# EAGLE design SparrowAprsArt (EAGLE 9.1.3)
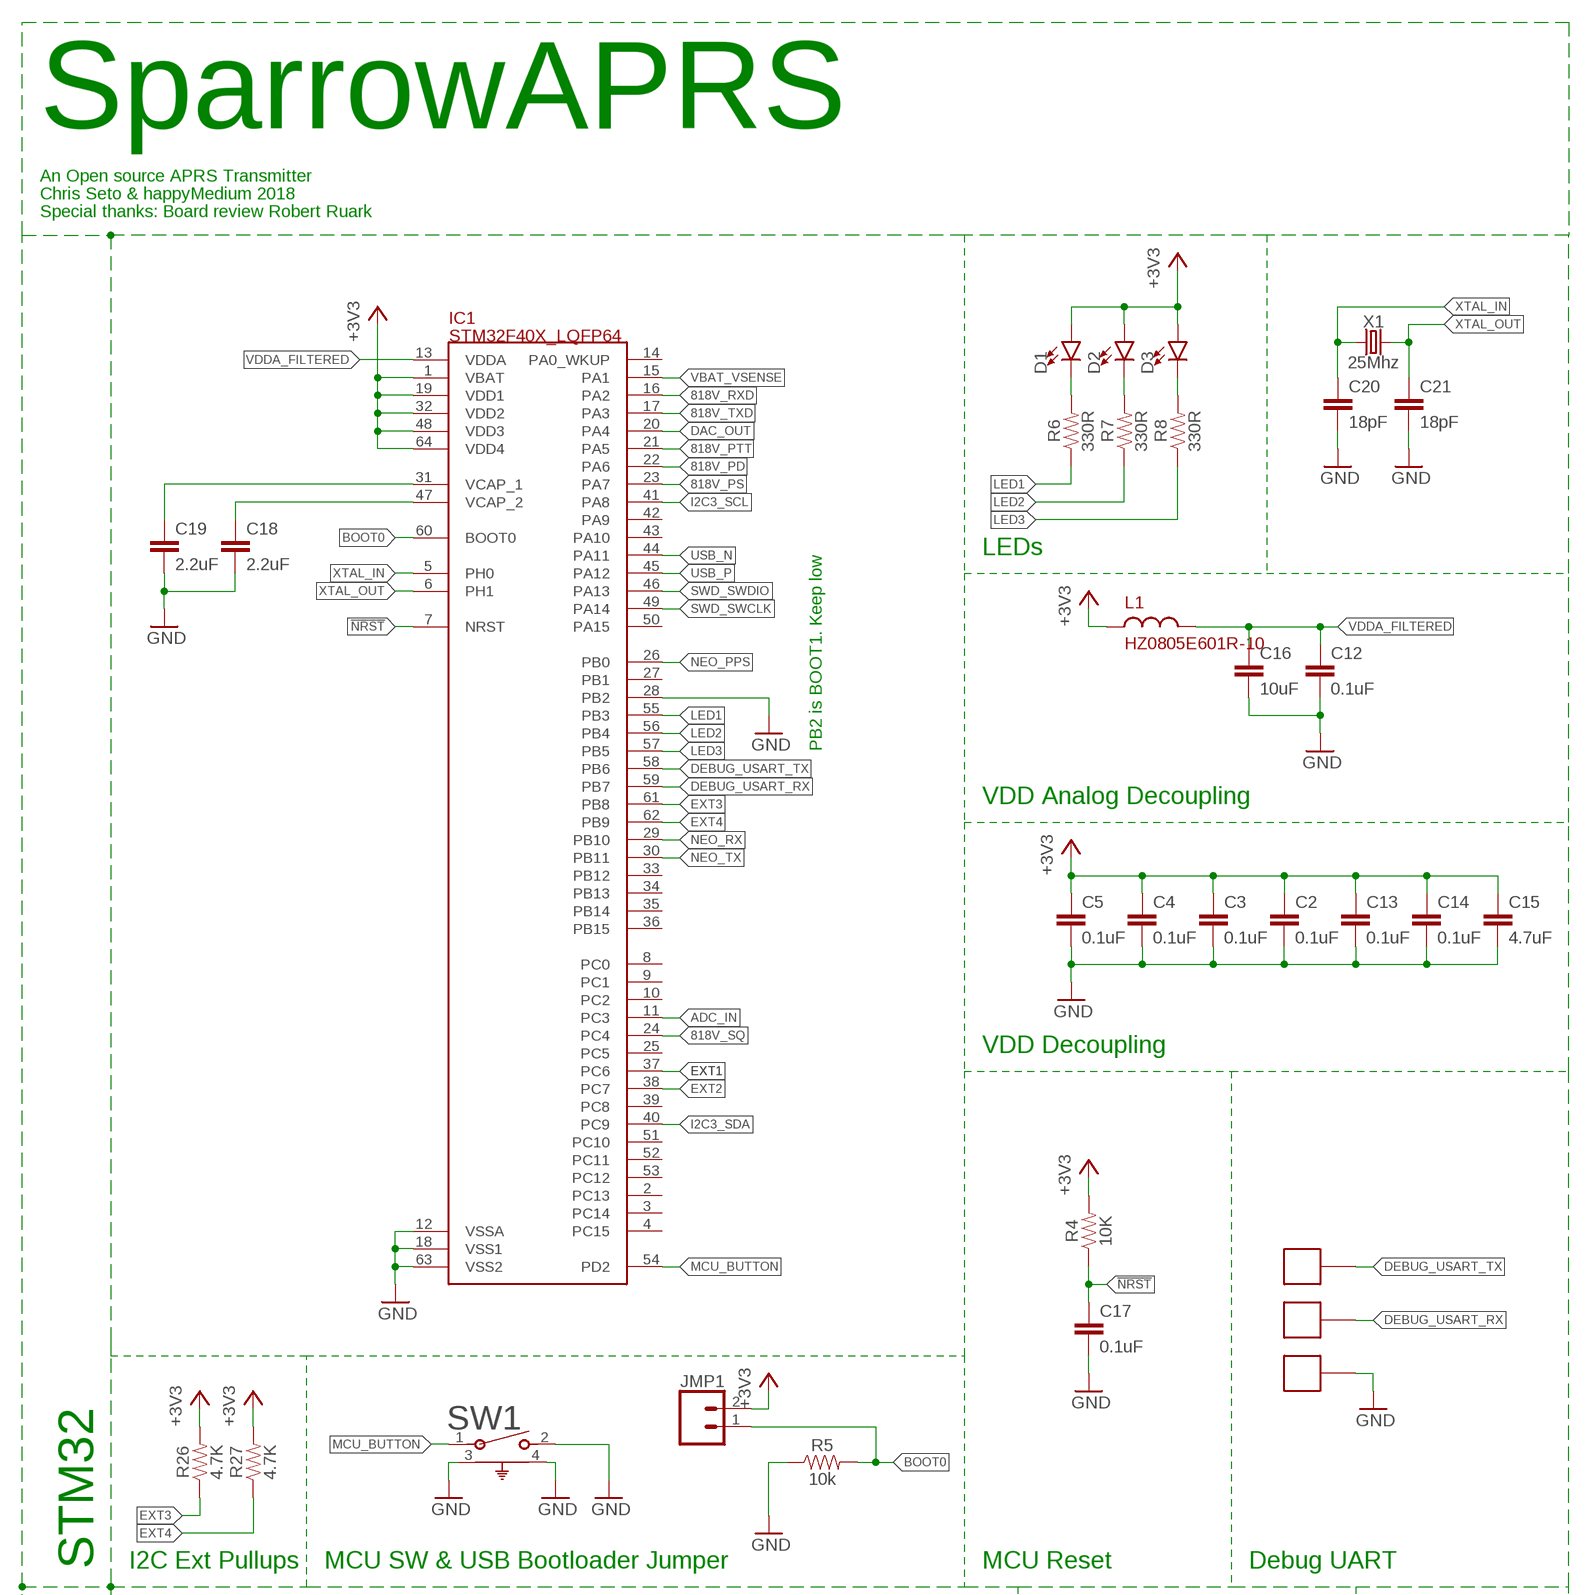
[diagram p0: schematic, sheet 1, part 1 of 2]
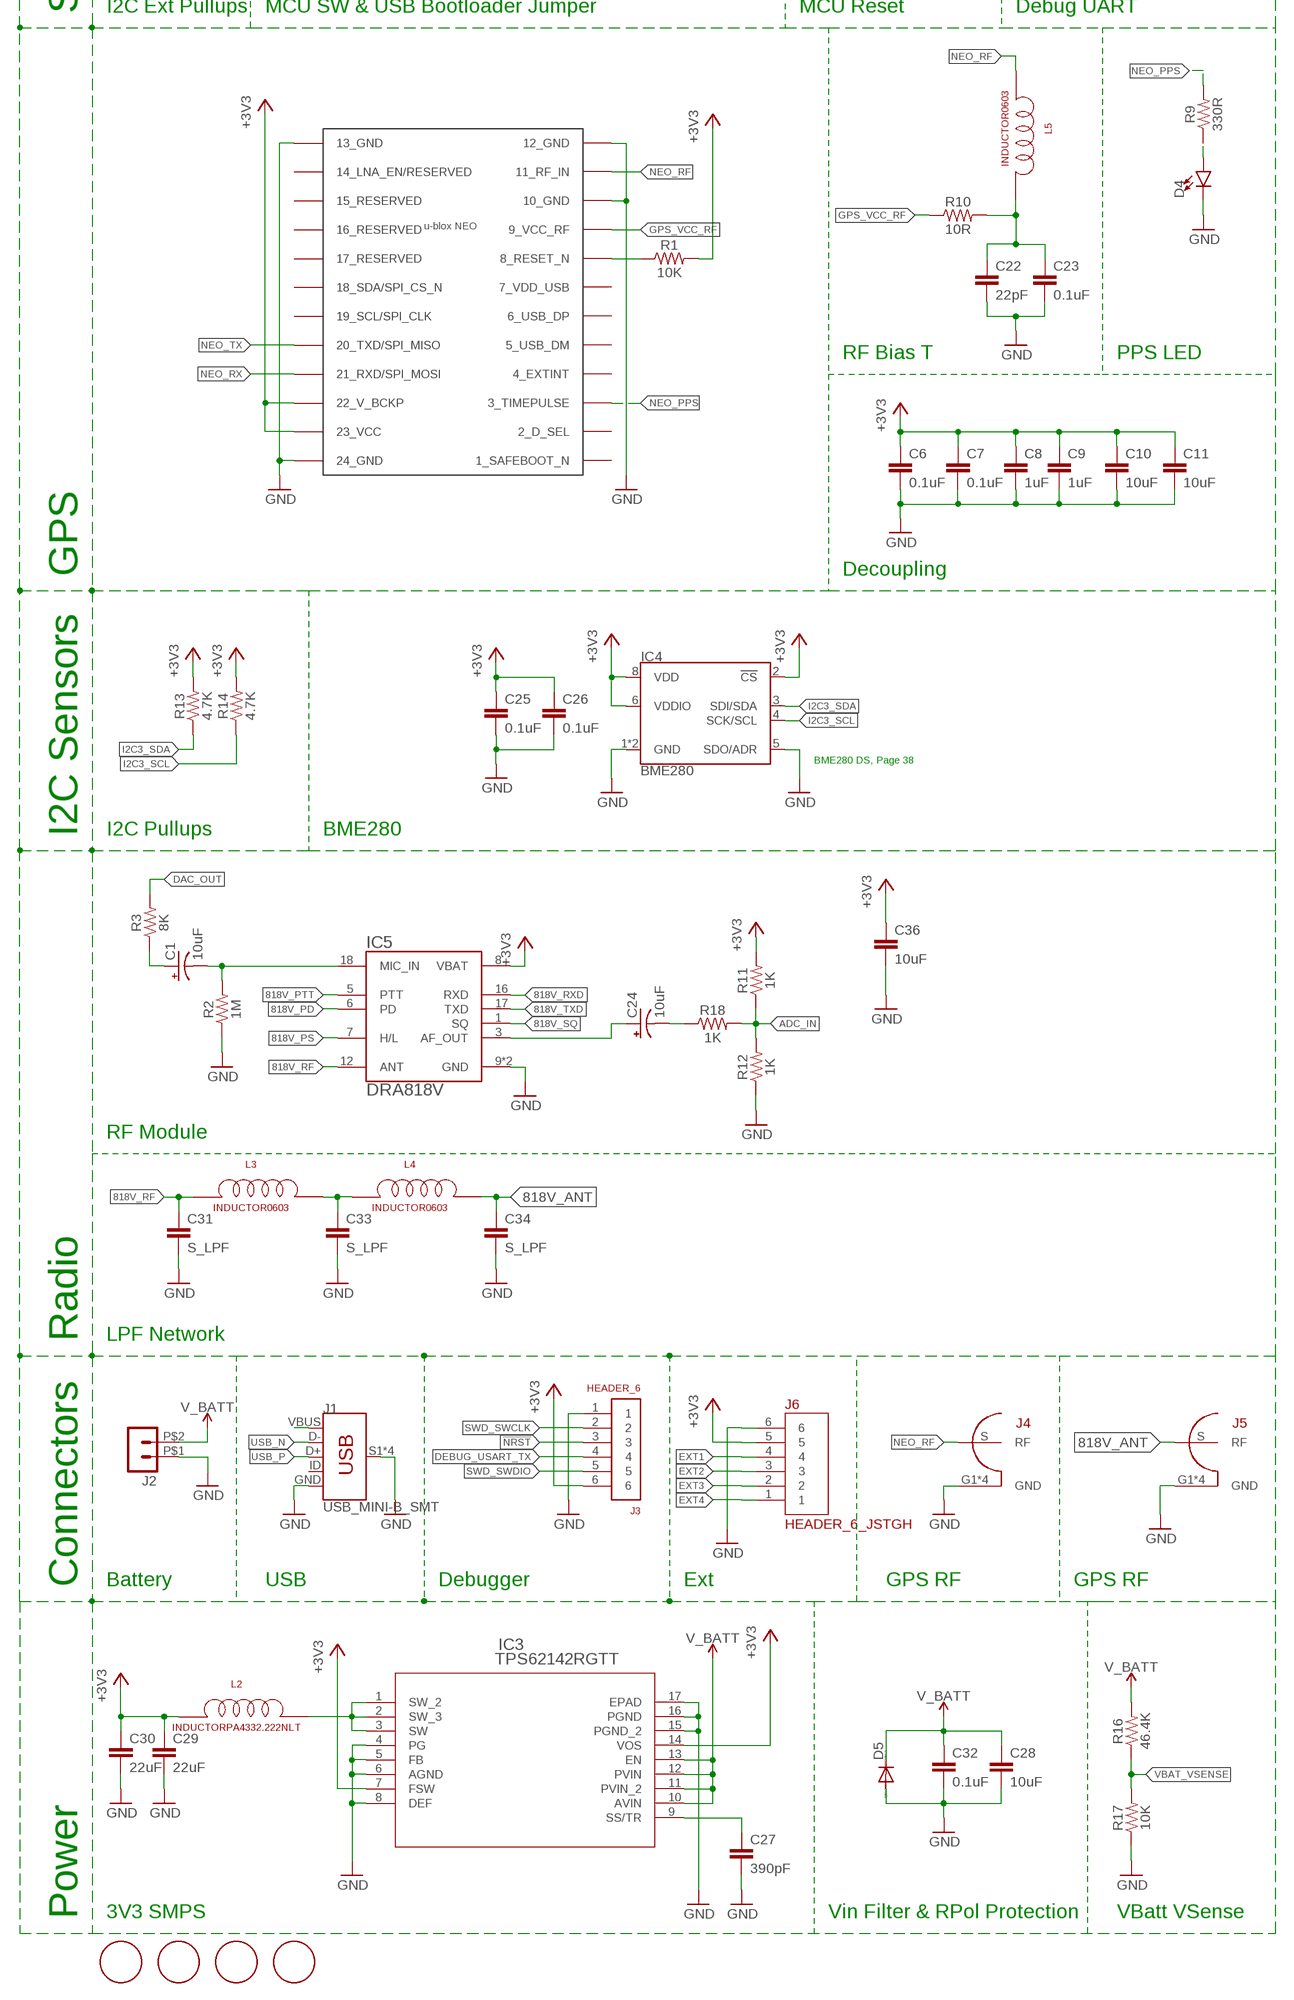
[diagram p1: schematic, sheet 1, part 2 of 2]

## Parts
C1  10uF  CAP_POL1206_POL  [1206]
C2  0.1uF  CAP0603  [0603]
C3  0.1uF  CAP0603  [0603]
C4  0.1uF  CAP0603  [0603]
C5  0.1uF  CAP0603  [0603]
C6  0.1uF  CAP0603  [0603]
C7  0.1uF  CAP0603  [0603]
C8  1uF  C-EUC0805  [C0805]
C9  1uF  C-EUC0805  [C0805]
C10  10uF  C-EUC0805  [C0805]
C11  10uF  C-EUC0805  [C0805]
C12  0.1uF  CAP0603  [0603]
C13  0.1uF  CAP0603  [0603]
C14  0.1uF  CAP0603  [0603]
C15  4.7uF  C-EUC0805  [C0805]
C16  10uF  C-EUC0805  [C0805]
C17  0.1uF  CAP0603  [0603]
C18  2.2uF  C-EUC0805  [C0805]
C19  2.2uF  C-EUC0805  [C0805]
C20  18pF  CAP0603  [0603]
C21  18pF  CAP0603  [0603]
C22  22pF  CAP0603  [0603]
C23  0.1uF  CAP0603  [0603]
C24  10uF  CAP_POL1206_POL  [1206]
C25  0.1uF  CAP0603  [0603]
C26  0.1uF  CAP0603  [0603]
C27  390pF  CAP0603  [0603]
C28  10uF  C-EUC0805  [C0805]
C29  22uF  CAP1210  [1210]
C30  22uF  CAP1210  [1210]
C31  S_LPF  CAP0603  [0603]
C32  0.1uF  CAP0603  [0603]
C33  S_LPF  CAP0603  [0603]
C34  S_LPF  CAP0603  [0603]
C36  10uF  C-EUC0805  [C0805]
D1  LED0603  [LED-0603]
D2  LED0603  [LED-0603]
D3  LED0603  [LED-0603]
D4  LED0603  [LED-0603]
D5  DIODE-DO214AC  [DO214AC]
IC1  STM32F40X_LQFP64  [STM32_LQFP64]
IC2  NEO-M8  [NEO-M8]
IC3  TPS62142RGTT  [RGT16_1P7X1P7]
IC4  BME280  [LGA-8-2.5X2.5]
IC5  DRA818V  [DORJI_DRA818V]
J1  USB_MINI-B_SMT  [USB-MINIB]
J2  HEADER_POS2_43650-0200  [43650-0200]
J3  HEADER_6  [6X2_SMT]
J4  FSK_RUARK2_SMA_0732511150  [FSK_RUARK2_WIDE_SMA]
J5  FSK_RUARK2_SMA_0732511150  [FSK_RUARK2_WIDE_SMA]
J6  HEADER_6_JSTGH  [BM06B-GHS-TBT(LF)(SN)(N)]
JMP1  CONN_02  [1X02]
L1  HZ0805E601R-10  [R0805]
L2  INDUCTORPA4332.222NLT  [PA4332.222NLT]
L3  INDUCTOR0603  [0603]
L4  INDUCTOR0603  [0603]
L5  INDUCTOR0603  [0603]
R1  10K  RESISTOR0603  [0603]
R2  1M  RESISTOR0603  [0603]
R3  8K  RESISTOR0603  [0603]
R4  10K  RESISTOR0603  [0603]
R5  10k  RESISTOR0603  [0603]
R6  330R  RESISTOR0603  [0603]
R7  330R  RESISTOR0603  [0603]
R8  330R  RESISTOR0603  [0603]
R9  330R  RESISTOR0603  [0603]
R10  10R  RESISTOR0603  [0603]
R11  1K  RESISTOR0603  [0603]
R12  1K  RESISTOR0603  [0603]
R13  4.7K  RESISTOR0603  [0603]
R14  4.7K  RESISTOR0603  [0603]
R16  46.4K  RESISTOR0603  [0603]
R17  10K  RESISTOR0603  [0603]
R18  1K  RESISTOR0603  [0603]
R26  4.7K  RESISTOR0603  [0603]
R27  4.7K  RESISTOR0603  [0603]
SW1  1825027-8  [SW2_1825027-C]
U$2  SINGLEPADMIDPAD  [MIDPAD]
U$3  SINGLEPADMIDPAD  [MIDPAD]
U$4  SINGLEPADMIDPAD  [MIDPAD]
U$7  MOUNTING_HOLE#2  [#2_CLEARANCE_HOLE]
U$8  MOUNTING_HOLE#2  [#2_CLEARANCE_HOLE]
U$9  MOUNTING_HOLE#2  [#2_CLEARANCE_HOLE]
U$10  MOUNTING_HOLE#2  [#2_CLEARANCE_HOLE]
X1  25Mhz  CRYSTALSMD-3.2X2.5  [CRYSTAL-SMD-3.2X2.5MM]

## Nets
818V_ANT: C34.1 J5.S(RF) L4.2
818V_PD: IC1.22(PA6) IC5.6(PD)
818V_PS: IC1.23(PA7) IC5.7(H/L)
818V_PTT: IC1.21(PA5) IC5.5(PTT)
818V_RF: C31.1 IC5.12(ANT) L3.1
818V_RXD: IC1.16(PA2) IC5.16(RXD)
818V_SQ: IC1.24(PC4) IC5.1(SQ)
818V_TXD: IC1.17(PA3) IC5.17(TXD)
!NRST: C17.1 IC1.7(NRST) J3.3 R4.1
+3V3: C2.1 C3.1 C4.1 C5.1 C6.1 C7.1 C8.1 C9.1 C10.1 C11.1 C13.1 C14.1 C15.1 C25.1 C26.1 C29.1 C30.1 C36.1 D1.A D2.A D3.A IC1.1(VBAT) IC1.19(VDD1) IC1.32(VDD2) IC1.48(VDD3) IC1.64(VDD4) IC2.22(22_V_BCKP) IC2.23(23_VCC) IC3.7(FSW) IC3.14(VOS) IC4.2(!CS) IC4.6(VDDIO) IC4.8(VDD) IC5.8(VBAT) J3.6 J6.5 JMP1.2 L1.1 L2.1 R1.2 R4.2 R11.2 R13.2 R14.2 R26.2 R27.2
ADC_IN: IC1.11(PC3) R11.1 R12.2 R18.2
BOOT0: IC1.60(BOOT0) JMP1.1 R5.2
DAC_OUT: IC1.20(PA4) R3.2
DEBUG_USART_RX: IC1.59(PB7) U$3.1
DEBUG_USART_TX: IC1.58(PB6) J3.4 U$2.1
EXT1: IC1.37(PC6) J6.4
EXT2: IC1.38(PC7) J6.3
EXT3: IC1.61(PB8) J6.2 R26.1
EXT4: IC1.62(PB9) J6.1 R27.1
GND: C2.2 C3.2 C4.2 C5.2 C6.2 C7.2 C8.2 C9.2 C10.2 C11.2 C12.2 C13.2 C14.2 C15.2 C16.2 C17.2 C18.2 C19.2 C20.2 C21.2 C22.2 C23.2 C25.2 C26.2 C27.2 C28.2 C29.2 C30.2 C31.2 C32.2 C33.2 C34.2 C36.2 D4.C D5.A IC1.12(VSSA) IC1.18(VSS1) IC1.28(PB2) IC1.63(VSS2) IC2.10(10_GND) IC2.12(12_GND) IC2.13(13_GND) IC2.24(24_GND) IC3.4(PG) IC3.5(FB) IC3.6(AGND) IC3.8(DEF) IC3.15(PGND_2) IC3.16(PGND) IC3.17(EPAD) IC4.1(GND) IC4.5(SDO/ADR) IC4.7(GND) IC5.9(GND) IC5.10(GND) J1.GND J1.S1(SHIELD) J1.S2(SHIELD) J1.S3(SHIELD) J1.S4(SHIELD) J2.P$1 J3.1 J4.G1(GND) J4.G2(GND) J4.G3(GND) J4.G4(GND) J5.G1(GND) J5.G2(GND) J5.G3(GND) J5.G4(GND) J6.6 R2.1 R5.1 R12.1 R17.1 SW1.2 SW1.3 SW1.4 U$4.1
GPS_VCC_RF: IC2.9(9_VCC_RF) R10.1
I2C3_SCL: IC1.41(PA8) IC4.4(SCK/SCL) R14.1
I2C3_SDA: IC1.40(PC9) IC4.3(SDI/SDA) R13.1
LED1: IC1.55(PB3) R6.1
LED2: IC1.56(PB4) R7.1
LED3: IC1.57(PB5) R8.1
MCU_BUTTON: IC1.54(PD2) SW1.1
N$2: C19.1 IC1.31(VCAP_1)
N$3: C18.1 IC1.47(VCAP_2)
N$4: IC2.8(8_RESET_N) R1.1
N$5: D2.C R7.2
N$7: D3.C R8.2
N$8: D1.C R6.2
N$9: C22.1 C23.1 L5.2 R10.2
N$10: D4.A R9.1
N$11: C1.1(+) R3.1
N$12: C24.2(-) R18.1
N$14: C1.2(-) IC5.18(MIC_IN) R2.2
N$15: C33.1 L3.2 L4.1
N$17: IC3.1(SW_2) IC3.2(SW_3) IC3.3(SW) L2.2
N$18: C24.1(+) IC5.3(AF_OUT)
N$19: J1.VBUS
N$21: C27.1 IC3.9(SS/TR)
NEO_PPS: IC1.26(PB0) IC2.3(3_TIMEPULSE) R9.2
NEO_RF: IC2.11(11_RF_IN) J4.S(RF) L5.1
NEO_RX: IC1.29(PB10) IC2.21(21_RXD/SPI_MOSI)
NEO_TX: IC1.30(PB11) IC2.20(20_TXD/SPI_MISO)
SWD_SWCLK: IC1.49(PA14) J3.2
SWD_SWDIO: IC1.46(PA13) J3.5
USB_N: IC1.44(PA11) J1.D-
USB_P: IC1.45(PA12) J1.D+
V_BATT: C28.1 C32.1 D5.C IC3.10(AVIN) IC3.11(PVIN_2) IC3.12(PVIN) IC3.13(EN) J2.P$2 R16.2
VBAT_VSENSE: IC1.15(PA1) R16.1 R17.2
VDDA_FILTERED: C12.1 C16.1 IC1.13(VDDA) L1.2
XTAL_IN: C20.1 IC1.5(PH0) X1.1
XTAL_OUT: C21.1 IC1.6(PH1) X1.3
Unconnected: IC1.2(PC13) IC1.3(PC14) IC1.4(PC15) IC1.8(PC0) IC1.9(PC1) IC1.10(PC2) IC1.14(PA0_WKUP) IC1.25(PC5) IC1.27(PB1) IC1.33(PB12) IC1.34(PB13) IC1.35(PB14) IC1.36(PB15) IC1.39(PC8) IC1.42(PA9) IC1.43(PA10) IC1.50(PA15) IC1.51(PC10) IC1.52(PC11) IC1.53(PC12) IC2.1(1_SAFEBOOT_N) IC2.2(2_D_SEL) IC2.4(4_EXTINT) IC2.5(5_USB_DM) IC2.6(6_USB_DP) IC2.7(7_VDD_USB) IC2.14(14_LNA_EN/RESERVED) IC2.15(15_RESERVED) IC2.16(16_RESERVED) IC2.17(17_RESERVED) IC2.18(18_SDA/SPI_CS_N) IC2.19(19_SCL/SPI_CLK) J1.ID

## Notes on the sheet
- SparrowAPRS
- An Open source APRS Transmitter
- Chris Seto & happyMedium 2018
- Special thanks: Board review Robert Ruark
- LEDs
- PB2 is BOOT1. Keep low
- VDD Analog Decoupling
- VDD Decoupling
- STM32 | I2C Ext Pullups | MCU SW & USB Bootloader Jumper | MCU Reset | Debug UART
- RF Bias T | PPS LED
- GPS | Decoupling
- BME280 DS, Page 38
- I2C Sensors | I2C Pullups | BME280
- RF Module
- Radio | LPF Network
- Connectors | Battery | USB | Debugger | Ext | GPS RF | GPS RF
- Power | 3V3 SMPS | Vin Filter & RPol Protection | VBatt VSense

## Library data of the parts
C1 C24 = HappyMedium:CAP_POL
C2-C7 C12-C14 C17 C20-C23 C25-C27 C29-C34 = HappyMedium:CAP
C8-C11 C15 C16 C18 C19 C28 C36 = resistor:C-EU: CAPACITOR, European symbol
D1-D4 = SparkFun-LED:LED: LED (Generic) Standard schematic elements and footprints for 5mm, 3mm, 1206, and 0603 sized LEDs. Generic LEDs with no color specified.
D5 = diode:DIODE-: DIODE
IC1 = HappyMedium:STM32F40X_LQFP64
IC2 = ubloxLib:NEO-M8: u-blox NEO GNSS module
IC3 = TPS62142RGTT:TPS62142RGTT; MANUFACTURER_PART_NUMBER: TPS62142RGTT; VENDOR: Texas Instruments
IC4 = SparkFun-Sensors:BME280: Bosch BME280 – Combined Humidity and Pressure Sensor The BME280 is as combined digital humidity, pressure and temperature sensor based on proven sensing principles. The sensor module is housed in an extremely compact metal-lid LGA package with a footprint of only 2.5×2.5mm² with a height of 0.93mm. Its small dimensions and its low power consumption allow the implementation in battery driven devices such as handsets, GPS modules or watches. Datasheet <https://cdn.sparkfun.com/assets/learn_tutorials/4/1/9/BST-BME280_DS001-10.pdf> SparkFun Products SparkFun Atmospheric Sensor Breakout - BME280 <https://www.sparkfun.com/products/13676> (SEN-13676); PROD_ID: IC-13090
IC5 = DRA818V:DRA818V: VHF Band Voice Transceiver Module; AVAILABILITY: Unavailable; MF: DORJI; MP: DRA818V; PACKAGE: Package Analog Devices; PRICE: None
J1 = SparkFun-Connectors:USB_MINI-B: USB type Mini-B Connector Breaks out 5th pin, and includes shield pins if needed. SparkFun Products: SparkFun FTDI Basic Breakout <https://www.sparkfun.com/products/9716> SparkFun XBee Explorer USB <https://www.sparkfun.com/products/11812> SparkFun Redboard <https://www.sparkfun.com/products/12757>; PROD_ID: CONN-08193; SF_ID: PRT-00587
J2 = con-molex-micro-fit-3_0:HEADER_POS2_?: Molex - Micro-Fit 3.0 Series connector, 3.00mm (0.118") pitch header, 2 positions.
J3 = HappyMedium:HEADER_6
J4 J5 = UsbBoard:FSK_RUARK2_SMA_0732511150
J6 = HappyMedium:HEADER_6_
JMP1 = SparkFun-Connectors:CONN_02: Multi connection point. Often used as Generic Header-pin footprint for 0.1 inch spaced/style header connections On any of the 0.1 inch spaced packages, you can populate with these: Break Away Headers - Straight <https://www.sparkfun.com/products/116> (PRT-00116) Break Away Male Headers - Right Angle <https://www.sparkfun.com/products/553> (PRT-00553) Female Headers <https://www.sparkfun.com/products/115> (PRT-00115) Break Away Headers - Machine Pin <https://www.sparkfun.com/products/117> (PRT-00117) Break Away Female Headers - Swiss Machine Pin <https://www.sparkfun.com/products/743> (PRT-00743) For SCREWTERMINALS and SPRING TERMINALS visit here: Screw Terimnals on SparkFun.com <https://www.sparkfun.com/search/results?term=Screw+Terminals> (5mm/3.5mm/2.54mm spacing) This device is also useful as a general connection point to wire up your design to another part of your project. Our various solder wires solder well into these plated through hole pads. Hook-Up Wire - Assortment (Stranded, 22 AWG) <https://www.sparkfun.com/products/11375> (PRT-11375) Hook-Up Wire - Assortment (Solid Core, 22 AWG) <https://www.sparkfun.com/products/11367> (PRT-11367) View the entire wire category on our website here <https://www.sparkfun.com/categories/141> Special notes: Molex polarized connector foot print use with: PRT-08233 with associated crimp pins and housings. 2.54_SCREWTERM for use with PRT-10571. 3.5mm Screw Terminal footprints for PRT-08084 5mm Screw Terminal footprints for use with PRT-08432
L1 = HappyMedium:HZ0805E601R-10
L2-L5 = HappyMedium:INDUCTOR
R1-R14 R16-R18 R26 R27 = SparkFun-Resistors:RESISTOR: Generic Resistor Package
SW1 = button:1825027-8; MANUFACTURER_PART_NUMBER: 18250278; VENDOR: TE Connectivity
U$2-U$4 = HappyMedium:SINGLEPAD
U$7-U$10 = HappyMedium:MOUNTING_HOLE
X1 = SparkFun-Clocks:CRYSTAL: Crystals (Generic) These are passive quartz crystals, which can be used as a clock source for a microcontroller. Crystal's are two-terminal devices. They require external "load" capacitors to generate an oscillating signal.

## Board
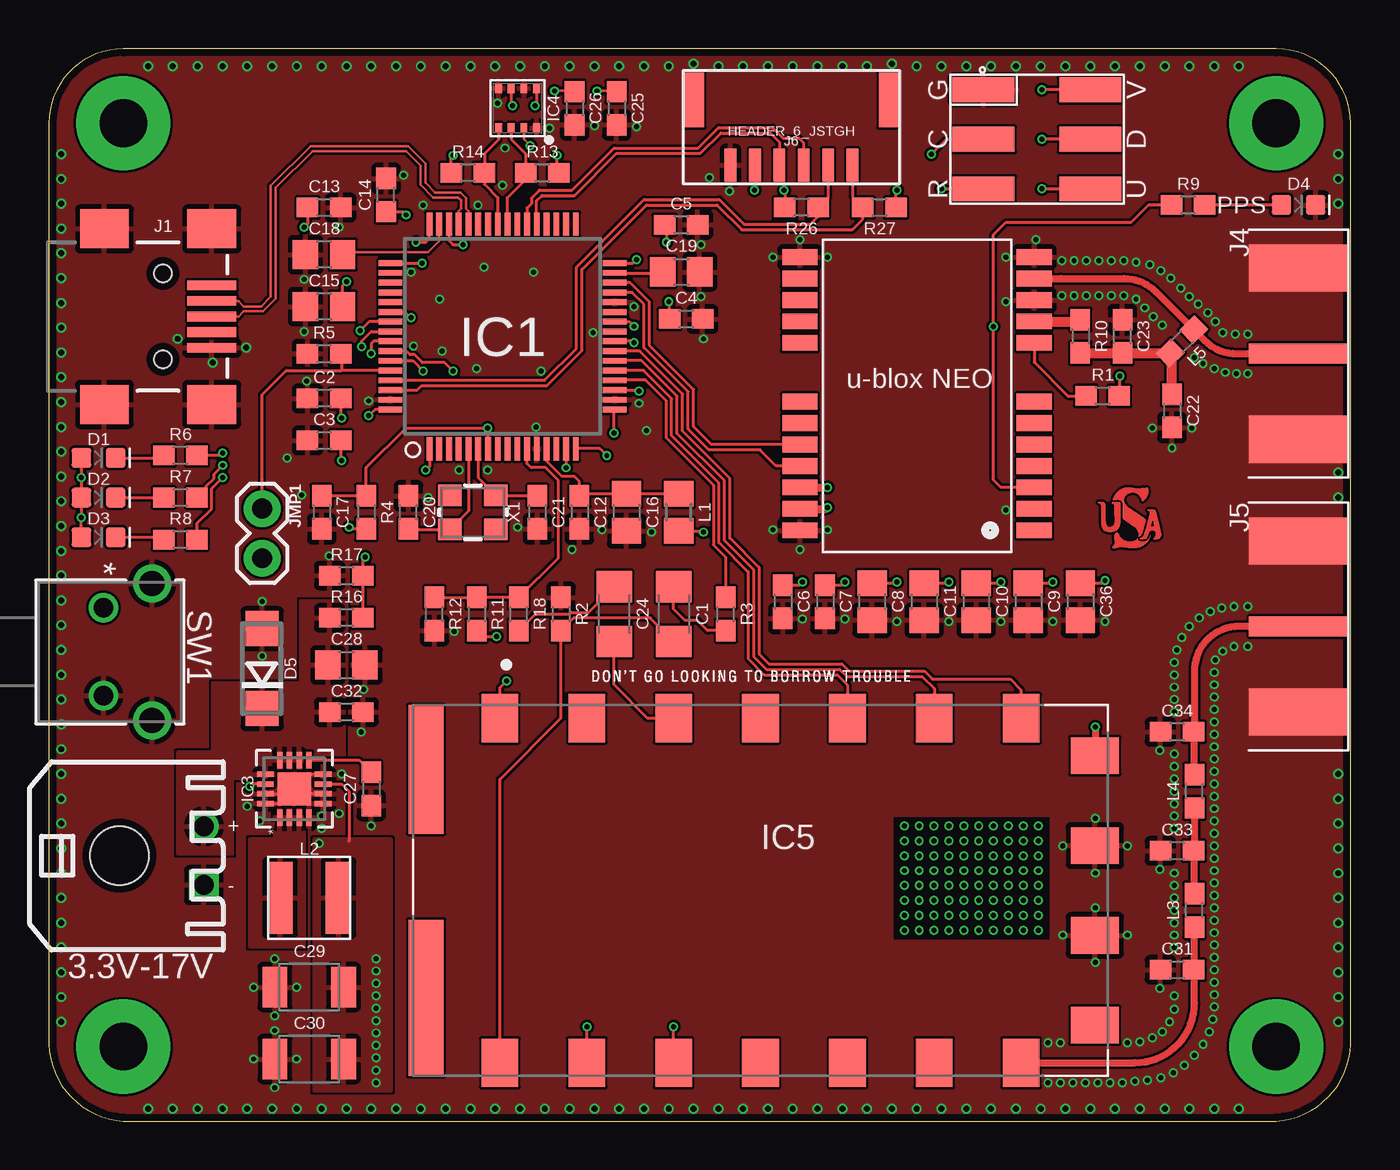
[diagram p2: board, top side]
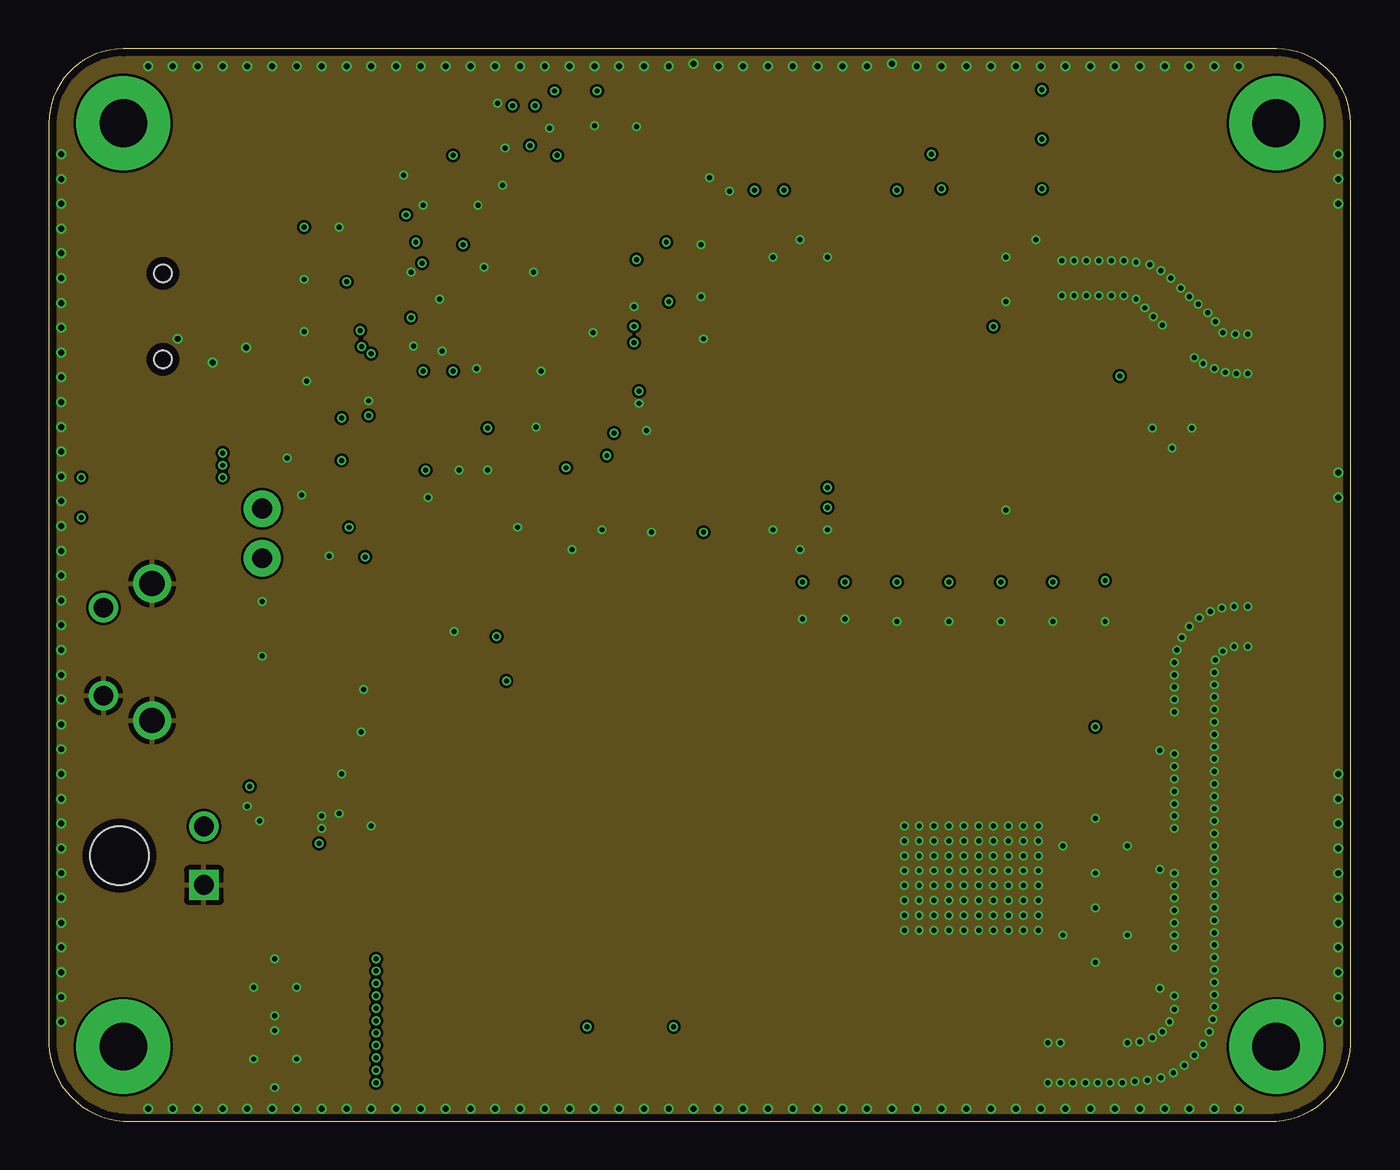
[diagram p3: board, inner layer Route2]
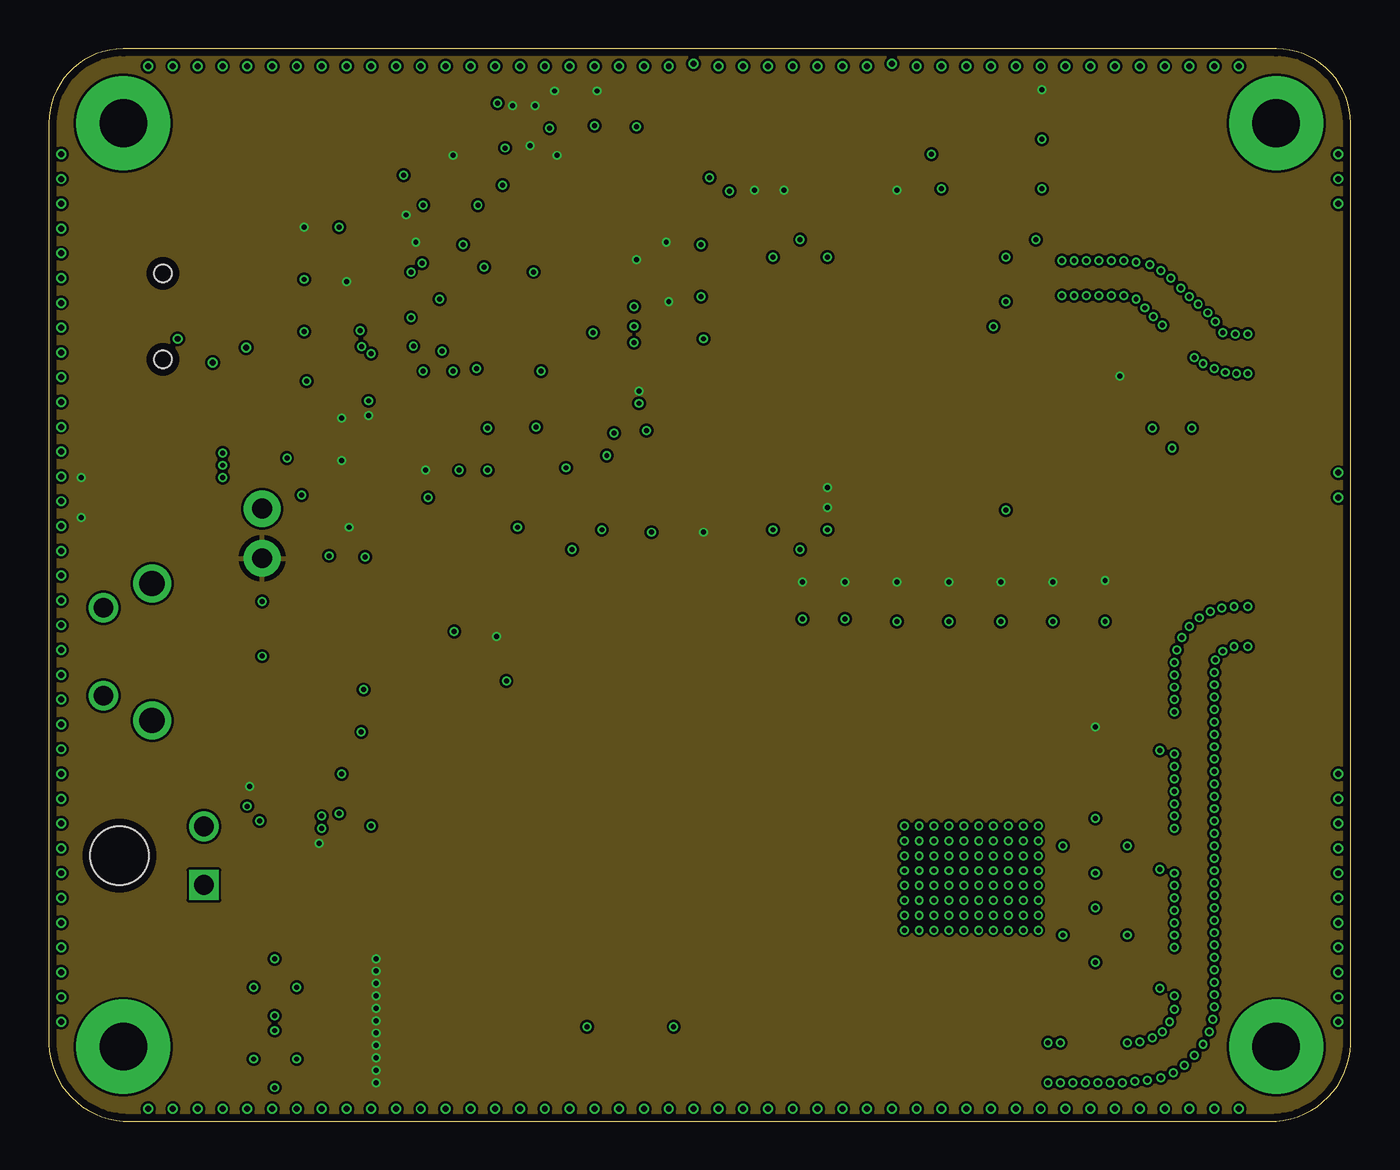
[diagram p4: board, inner layer Route15]
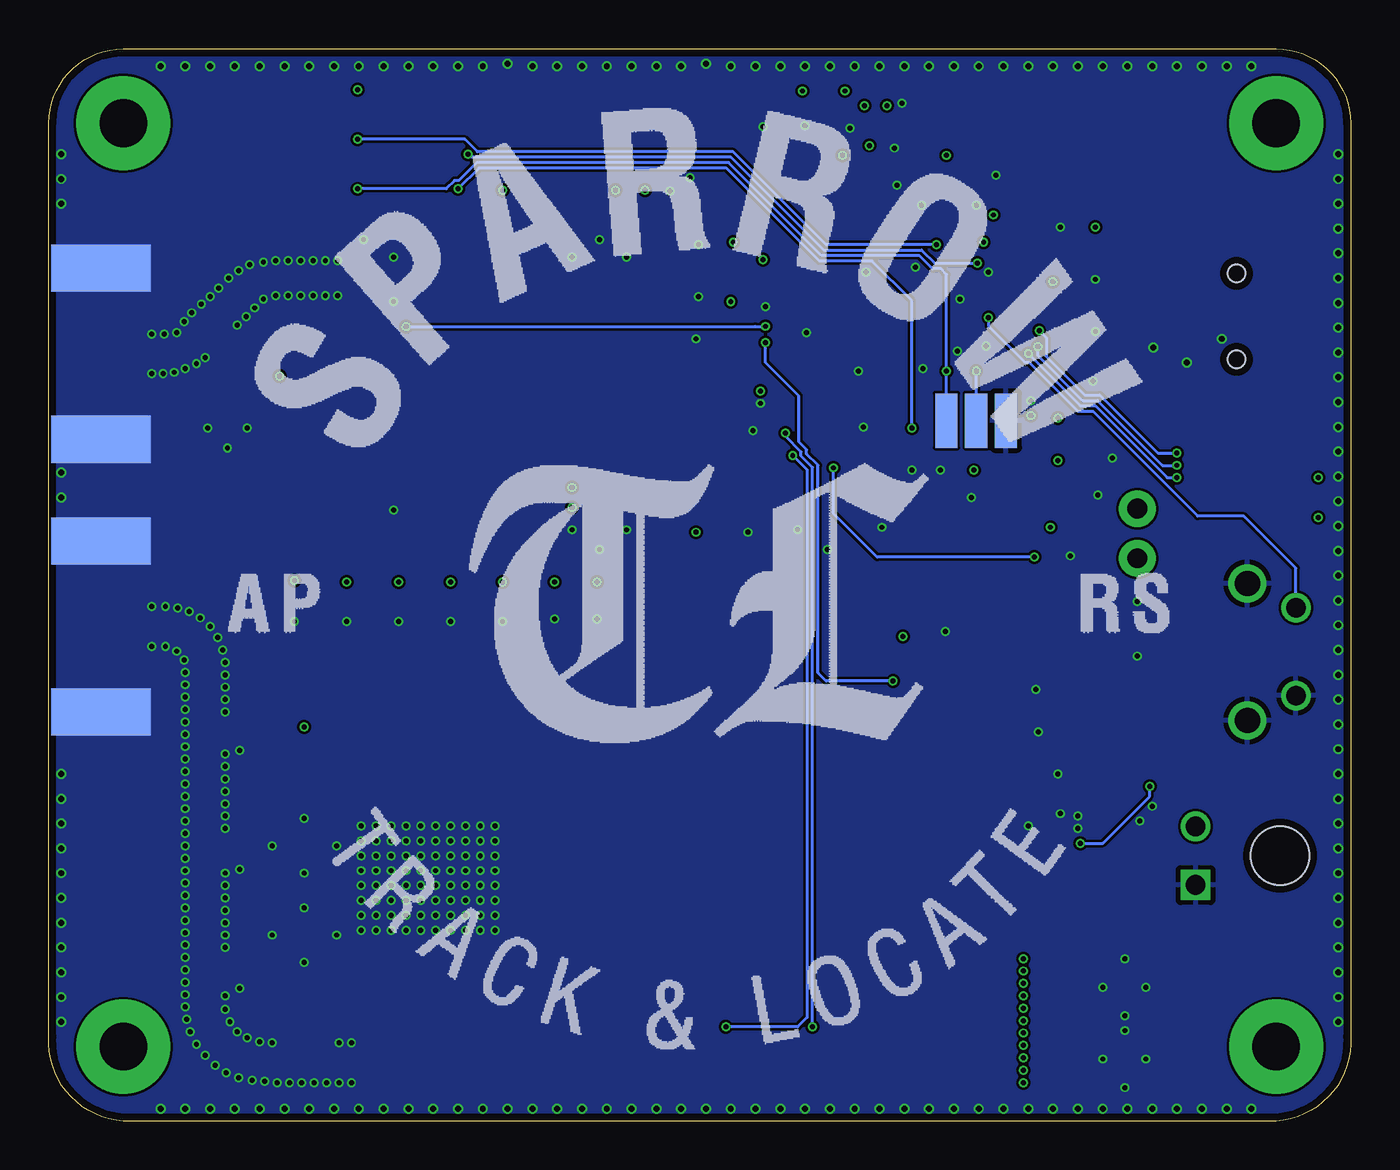
[diagram p5: board, bottom side, seen from below]

Size 66.69 x 54.93 mm. Coordinates in mm from the lower left corner, seen from the top.
Outline: 3.82,0 62.87,0 arc90 66.68,4.32 66.68,51.12 arc90 62.87,54.93 3.82,54.93 arc90 0.01,51.12 0.01,4.32 arc90 3.82,0
Copper layers (1*2*15*16): Top 0.035559375mm / dielectric 0.17018125mm / Route2 0.01778125mm / dielectric 47mil / Route15 0.01778125mm / dielectric 0.17018125mm / Bottom 0.035559375mm
Design rules "oshpark-4layer *": minimum track width 5mil, minimum drill 10mil, track to track 5mil, track to pad 5mil, pad to pad 5mil, via to via 5mil, smd to smd 5mil, copper to edge 15mil, drill to drill 6mil, minimum pad ring 4mil, minimum via ring 4mil, stop-mask expansion 2.5mil, vias tented up to drill 14mil, thermal gap 10mil

### Footprints (pad centres in the part's own frame; a part is rotated, then mirrored left to right if it is on the bottom)
1206 = smd 1.6 x 1.8: 1 -1.4,0; 2 1.4,0
0603 = smd 1.1 x 1: 1 -0.85,0; 2 0.85,0
C0805 = smd 1.3 x 1.5: 1 -0.95,0; 2 0.95,0
1210 = smd 1.27 x 2.06: 1 -1.755,0; 2 1.755,0
LED-0603 = smd 1 x 1: A -0.877,0; C 0.877,0
DO214AC = smd 1.8 x 1.7: A 2.05,0; C -2.05,0
STM32_LQFP64 = smd 0.3 x 1.2: 1 -3.75,-5.75; 2 -3.25,-5.75; 3 -2.75,-5.75; 4 -2.25,-5.75; 5 -1.75,-5.75; 6 -1.25,-5.75; 7 -0.75,-5.75; 8 -0.25,-5.75; 9 0.25,-5.75; 10 0.75,-5.75; 11 1.25,-5.75; 12 1.75,-5.75; 13 2.25,-5.75; 14 2.75,-5.75; 15 3.25,-5.75; 16 3.75,-5.75; 33 3.75,5.75; 34 3.25,5.75; 35 2.75,5.75; 36 2.25,5.75; 37 1.75,5.75; 38 1.25,5.75; 39 0.75,5.75; 40 0.25,5.75; 41 -0.25,5.75; 42 -0.75,5.75; 43 -1.25,5.75; 44 -1.75,5.75; 45 -2.25,5.75; 46 -2.75,5.75; 47 -3.25,5.75; 48 -3.75,5.75 | smd 1.2 x 0.3: 17 5.75,-3.75; 18 5.75,-3.25; 19 5.75,-2.75; 20 5.75,-2.25; 21 5.75,-1.75; 22 5.75,-1.25; 23 5.75,-0.75; 24 5.75,-0.25; 25 5.75,0.25; 26 5.75,0.75; 27 5.75,1.25; 28 5.75,1.75; 29 5.75,2.25; 30 5.75,2.75; 31 5.75,3.25; 32 5.75,3.75; 49 -5.75,3.75; 50 -5.75,3.25; 51 -5.75,2.75; 52 -5.75,2.25; 53 -5.75,1.75; 54 -5.75,1.25; 55 -5.75,0.75; 56 -5.75,0.25; 57 -5.75,-0.25; 58 -5.75,-0.75; 59 -5.75,-1.25; 60 -5.75,-1.75; 61 -5.75,-2.25; 62 -5.75,-2.75; 63 -5.75,-3.25; 64 -5.75,-3.75
NEO-M8 = smd 1.8 x 0.8: 1 6.4,-7.4; 2 6.4,-6.3; 3 6.4,-5.2; 4 6.4,-4.1; 5 6.4,-3; 6 6.4,-1.9; 7 6.4,-0.8; 8 6.4,2.2; 9 6.4,3.3; 10 6.4,4.4; 11 6.4,5.5; 12 6.4,6.6; 13 -5.6,6.6; 14 -5.6,5.5; 15 -5.6,4.4; 16 -5.6,3.3; 17 -5.6,2.2; 18 -5.6,-0.8; 19 -5.6,-1.9; 20 -5.6,-3; 21 -5.6,-4.1; 22 -5.6,-5.2; 23 -5.6,-6.3; 24 -5.6,-7.4
RGT16_1P7X1P7 = smd 0.85 x 0.28: 1 -1.475,0.75; 2 -1.475,0.25; 3 -1.475,-0.25; 4 -1.475,-0.75; 9 1.475,-0.75; 10 1.475,-0.25; 11 1.475,0.25; 12 1.475,0.75 | smd 0.28 x 0.85: 5 -0.75,-1.475; 6 -0.25,-1.475; 7 0.25,-1.475; 8 0.75,-1.475; 13 0.75,1.475; 14 0.25,1.475; 15 -0.25,1.475; 16 -0.75,1.475 | smd 1.7 x 1.7: 17 0,0
LGA-8-2.5X2.5 = smd 0.35 x 0.5: 1 -0.975,1.025; 2 -0.325,1.025; 3 0.325,1.025; 4 0.975,1.025; 5 0.975,-1.025; 6 0.325,-1.025; 7 -0.325,-1.025; 8 -0.975,-1.025
DORJI_DRA818V = smd 1.88 x 2.47: 1 -13.35,8.825; 2 -8.9,8.825; 3 -4.45,8.825; 4 0,8.825; 5 4.45,8.825; 6 8.9,8.825; 7 13.35,8.825; 12 13.35,-8.825; 13 8.9,-8.825; 14 4.45,-8.825; 15 0,-8.825; 16 -4.45,-8.825; 17 -8.9,-8.825; 18 -13.35,-8.825 | smd 2.47 x 1.88: 8 17.125,6.9; 9 17.125,2.3; 10 17.125,-2.3; 11 17.125,-6.9 | smd 1.8 x 6.6: P2 -17.125,6.2 | smd 1.8 x 8: P3 -17.125,-5.5
USB-MINIB = smd 2.5 x 0.5: D+ 2.5,0; D- 2.5,0.8; GND 2.5,-1.6; ID 2.5,-0.8; VBUS 2.5,1.6 | smd 2.5 x 2: S1 -3,4.5; S2 2.5,4.5; S3 -3,-4.5; S4 2.5,-4.5 | hole 0.9: 0,2.2; 0,-2.2
43650-0200 = drill 1.02 square: P$1 1.5,4.32 | drill 1.02: P$2 -1.5,4.32 | hole 3: 0,0
6X2_SMT = smd 1.27 x 3.175: 1 -2.54,-2.731; 2 0,-2.731; 3 2.54,-2.731; 4 2.54,2.731; 5 0,2.731; 6 -2.54,2.731
FSK_RUARK2_WIDE_SMA = smd 5.08 x 2.413 bottom: G1 0,4.381; G4 0,-4.381 | smd 5.08 x 2.413: G2 0,-4.381; G3 0,4.381 | smd 5.08 x 1.016: S 0,0
BM06B-GHS-TBT(LF)(SN)(N) = smd 0.6 x 1.7: 1 -3.125,0; 2 -1.875,0; 3 -0.625,0; 4 0.625,0; 5 1.875,0; 6 3.125,0 | smd 1 x 2.8: GND1 -4.975,-3.35; GND2 4.975,-3.35
1X02 = drill 1.016 pad 1.88: 1 0,0; 2 2.54,0
R0805 = smd 1.3 x 1.5: 1 -0.95,0; 2 0.95,0
PA4332.222NLT = smd 3.7 x 1.3: 1 0,1.5; 2 0,-1.5
SW2_1825027-C = drill 0.991 pad 1.499: 1 0,0; 2 4.496,0 | drill 1.295 pad 1.803: 3 -1.245,2.489; 4 5.766,2.489
MIDPAD = smd 2.794 x 1.143: 1 0,0
#2_CLEARANCE_HOLE = drill 2.438 pad 4.826: 1 0,0
CRYSTAL-SMD-3.2X2.5MM = smd 1.2 x 1.1: 1 -1.175,-0.875; 2 1.175,-0.875; 3 1.175,0.875; 4 -1.175,0.875

### Placement (x,y rotation side)
C1  32.01,25.97 270 top
C2  14.1,37.02 180 top
C3  14.1,34.86 180 top
C4  32.65,41.08 0 top
C5  32.39,45.91 0 top
C6  37.6,26.61 270 top
C7  39.76,26.61 270 top
C8  42.17,26.61 270 top
C9  50.17,26.61 270 top
C10  47.5,26.61 270 top
C11  44.84,26.61 270 top
C12  27.18,31.18 270 top
C13  14.1,46.8 0 top
C14  17.28,47.43 90 top
C15  14.1,41.72 180 top
C16  29.6,31.18 270 top
C17  13.98,31.18 270 top
C18  14.1,44.39 180 top
C19  32.39,43.5 0 top
C20  18.42,31.18 90 top
C21  25.03,31.18 270 top
C22  57.54,36.39 270 top
C23  55,40.2 90 top
C24  28.96,25.97 90 top
C25  29.09,51.88 270 top
C26  26.93,51.88 270 top
C27  16.52,17.02 270 top
C28  15.25,23.37 0 top
C29  13.34,6.86 180 top
C30  13.34,3.17 180 top
C31  57.79,7.75 180 top
C32  15.25,20.95 0 top
C33  57.79,13.84 180 top
C34  57.79,19.94 180 top
C36  52.84,26.61 270 top
D1  2.55,33.97 0 top
D2  2.55,31.94 0 top
D3  2.55,29.91 0 top
D4  64.01,46.93 0 top
D5  10.93,23.18 90 top
IC1  23.25,40.2 0 top
IC2  44.08,37.66 0 top
IC3  12.58,17.02 90 top
IC4  24.01,51.88 180 top
IC5  36.46,11.81 0 top
J1  5.85,41.21 0 top
J2  3.63,13.59 270 top
J3  50.62,50.29 270 top
J4  64.01,39.31 0 top
J5  64.01,25.34 0 top
J6  38.04,48.96 180 top
JMP1  10.93,31.37 270 top
L1  32.26,31.18 90 top
L2  13.34,11.43 270 top
L3  58.68,10.79 90 top
L4  58.68,16.89 90 top
L5  58.05,39.94 225 top
R1  53.98,37.15 0 top
R2  26.23,25.97 270 top
R3  34.68,25.97 90 top
R4  16.26,31.18 270 top
R5  14.1,39.31 0 top
R6  6.74,34.1 180 top
R7  6.74,31.94 180 top
R8  6.74,29.78 180 top
R9  58.36,46.93 180 top
R10  52.84,40.2 270 top
R11  21.91,25.97 270 top
R12  19.75,25.97 90 top
R13  25.28,48.58 0 top
R14  21.47,48.58 180 top
R16  15.25,25.78 180 top
R17  15.25,27.94 0 top
R18  24.07,25.97 90 top
R26  38.55,46.8 180 top
R27  42.55,46.8 0 top
SW1  2.8,26.29 270 top
U$2  20.71,35.88 270 bottom
U$3  19.18,35.88 270 bottom
U$4  17.66,35.88 270 bottom
U$7  3.82,51.12 0 top
U$8  3.82,3.81 0 top
U$9  62.87,51.12 0 top
U$10  62.87,3.81 0 top
X1  21.72,31.18 0 top

### Tracks (layer width: path | path; a pad name or v marks a point on that pad's centre or on a via)
818V_ANT
  Top 0.152: 58.68,19.81 C34.1
  Top 0.318: 58.68,19.94 C34.1
  Top 0.356: L4.2 58.68,19.81 | J5.S 60.97,25.34 arc90 58.68,23.05 58.68,19.94
818V_PD
  Top 0.152: IC1.22 30.37,38.95 32.19,37.12 32.19,35.22 34.6,32.81 34.6,29.75 36.1,28.25 36.1,23.8 36.76,23.14 40.51,23.14 40.88,22.77 44.74,22.77 45.36,22.15 IC5.6
818V_PS
  Top 0.152: IC1.23 30.26,39.45 32.47,37.24 32.47,35.34 34.88,32.92 34.88,29.86 36.38,28.36 36.38,23.92 36.88,23.42 40.62,23.42 40.99,23.05 44.85,23.05 45.26,22.64 49.24,22.64 49.81,22.08 IC5.7
818V_PTT
  Top 0.152: IC1.21 30.47,38.45 31.91,37.01 31.91,35.1 34.32,32.69 34.32,29.63 35.82,28.13 35.82,23.69 36.65,22.86 40.39,22.86 40.91,22.35 IC5.5
818V_RF
  Top 0.152: 58.64,9.95 L3.1
  Top 0.318: 58.68,7.75 C31.1
  Top 0.356: 58.68,7.79 L3.1 | IC5.12 55.63,2.99 arc90 58.68,6.03 58.68,7.75
  Top 1.016: C31.1 58.68,7.79
818V_RXD  (via drill 0.25)
  Top 0.152: v28.58,34.1 28.24,34.45 IC1.16 | IC5.16 v32.01,4.82 v32.01,4.83
  Bottom 0.152: v32.01,4.83 28.33,4.83 27.84,5.31 27.84,33.36 v28.58,34.1
818V_SQ  (via drill 0.25)
  Top 0.152: IC5.1 23.11,22.21 v23.44,22.54 | v29.98,39.88 29.91,39.95 IC1.24
  Bottom 0.152: v23.44,22.54 26.87,22.54 27.29,22.96 27.29,33.59 27.87,34.18 27.87,34.39 28.27,34.79 28.27,35.24 28.26,35.24 28.26,37.15 29.98,38.86 v29.98,39.88
818V_TXD  (via drill 0.25)
  Top 0.152: IC5.17 v27.57,4.83 | v28.96,35.24 28.96,36.41 IC1.17
  Bottom 0.152: v27.57,4.83 27.57,33.48 28.15,34.06 28.15,34.28 28.96,35.09 v28.96,35.24
!NRST  (via drill 0.25)
  Top 0.152: IC1.7 22.5,35.48 v22.49,35.5 18.29,35.5 16.26,33.47 R4.1 C17.1 | v45.73,47.75 J3.3
  Bottom 0.152: v22.49,35.5 22.49,42.02 24.52,44.06 27.21,44.06 31.98,48.82 44.66,48.82 v45.73,47.75
+3V3  (via drill 0.25)
  Top 0.127: IC4.2 24.33,50.28 v24.64,49.97 | C26.1 26.89,52.77 v25.91,52.77 | C25.1 29.05,52.77 v28.07,52.77
  Top 0.152: IC1.64 16.7,36.45 v16.39,36.13 | IC1.1 19.5,33.52 v19.31,33.34 | IC1.19 30.19,37.45 v30.23,37.4 | IC1.32 29.92,43.95 v30.11,44.13 | L1.1 33.47,30.23 v33.53,30.16 | C14.1 18.13,46.58 v18.29,46.42 | C13.1 13.25,45.95 v13.09,45.78 | C8.1 43.37,27.56 v43.44,27.62 | 16.22,30.29 R4.2 15.46,30.33 v15.37,30.42 | C11.1 46.04,27.56 v46.11,27.62 | C10.1 48.71,27.56 v48.77,27.62 | C9.1 51.38,27.56 v51.44,27.62 | R1.2 54.87,37.19 v54.87,38.16 | D1.A 1.67,32.97 v1.66,32.96 1.67,32.94 D2.A 1.67,30.94 v1.66,30.92 1.67,30.91 D3.A | IC4.8 24.98,52.09 v24.9,52.01 | IC4.6 23.68,52.08 v23.76,52.01 | v18.8,45.02 19.31,45.02 19.5,45.21 IC1.48 | R13.2 26.04,48.67 v26.04,49.47 | 31.5,45.95 C5.1 31.63,45.82 v31.63,45.02 | R14.2 20.62,49.38 v20.71,49.47 | R11.2 22.21,24.83 v22.93,24.83 | C7.1 40.61,27.46 v40.77,27.62 | C6.1 38.45,27.46 v38.61,27.62 | C3.1 14.95,33.88 v14.99,33.85 | C2.1 14.95,36.04 v14.99,36.01 | C4.1 31.8,41.93 v31.76,41.97 | C15.1 15.05,42.8 v15.25,42.99 | IC3.7 15,17.27 15.37,16.89 15.37,14.35 | IC3.14 10.42,17.27 v10.29,17.14 | v37.66,47.69 37.7,47.65 R26.2 | R27.2 43.4,47.65 v43.44,47.69 | J6.5 36.17,47.72 v36.14,47.69 | J3.6 v50.87,52.83 | C36.1 53.98,27.56 v54.11,27.69
  Top 0.356: v53.6,20.19 53.6,18.73 arc-90 IC5.8
  Top 0.406: IC2.23 39.81,31.36 v39.88,31.43 | IC2.22 v39.88,32.46 v39.88,32.45
  Bottom 0.152: v10.29,17.14 10.29,16.64 12.71,14.22 v13.85,14.22
  other vias: 16.77,2.6 16.77,5.14 16.77,5.78 16.77,3.87 16.77,3.24 16.77,1.97 16.77,4.51 16.77,6.41 16.77,7.05 16.77,7.68 16.77,8.32
  pour Route15 (rank 6): -1.9,-1.91 68.21,-1.91 68.21,57.15 -1.9,57.15
  pour Top: 13.6,1.52 13.6,14.48 17.53,14.48 17.53,1.52
ADC_IN
  Top 0.152: R12.2 R11.1 R18.2 26.11,28.85 26.11,32.81 25.46,33.47 24.71,33.47 24.5,33.67 IC1.11
BOOT0
  Top 0.152: IC1.60 14.99,38.45 | R5.2 14.99,39.27 14.99,38.45 | JMP1.1 10.93,37.21 12.16,38.45 14.99,38.45
DAC_OUT
  Top 0.152: IC1.20 30.58,37.95 31.63,36.89 31.63,34.99 34.04,32.58 34.04,29.53 | 34.04,29.53 34.04,29.51 | R3.2 34.68,28.88 34.04,29.51 | 34.04,29.51 34.04,29.53
DEBUG_USART_RX  (via drill 0.25)
  Top 0.152: IC1.59 18.66,38.95 v19.18,38.42
  Bottom 0.152: U$3.1 v19.18,38.42
DEBUG_USART_TX  (via drill 0.25)
  Top 0.152: v20.71,38.42 20.28,38.85 19.15,38.85 18.74,39.26 18.5,39.26 18.32,39.43 17.51,39.43 IC1.58 | v50.87,47.75 J3.4
  Bottom 0.152: U$2.1 v20.71,38.42 20.71,43.37 21,43.67 21.42,43.67 22.09,44.34 27.1,44.34 31.86,49.1 44.78,49.1 45.69,48.18 45.91,48.18 46.34,47.75 v50.87,47.75
EXT1
  Top 0.152: IC1.37 25,47.15 25.25,47.41 26.92,47.41 29.08,49.57 33.38,49.57 34.42,50.61 36.96,50.61 37.42,50.16 J6.4
EXT2
  Top 0.152: IC1.38 24.5,46.77 24.72,46.99 24.72,47.27 25.14,47.69 26.8,47.69 28.96,49.85 33.27,49.85 34.31,50.89 37.08,50.89 37.61,50.35 38.42,50.35 38.68,50.1 38.67,50.09 J6.3
EXT3
  Top 0.152: IC1.61 25.41,37.95 27.03,39.57 27.03,43.74 30.5,47.21 34.35,47.21 35.62,45.94 39.02,45.94 39.4,46.32 R26.1 39.92,47.32 J6.2
EXT4
  Top 0.152: IC1.62 18.87,37.45 19.09,37.67 25.52,37.67 27.31,39.45 27.31,43.62 30.61,46.93 34.23,46.93 35.5,45.66 41.15,45.66 41.7,46.2 R27.1 41.17,47.33 J6.1
GND  (via drill 0.25, 0.3)
  Top 0.152: IC3.15 12.07,16.77 | 12.07,16.77 12.2,16.64 11.83,16.27 IC3.16 | IC3.17 12.33,16.77 12.07,16.77 | IC3.6 13.35,16.77 13.34,16.76 | IC3.8 13.23,17.77 13.21,17.78
  other vias: 16.39,36.89 22.99,52.13 49.03,44.26 49.03,41.97 30.23,36.77 38.61,25.72 13.09,40.45 28.33,30.29 30.87,30.16 13.21,37.91 18.17,48.45 14.87,45.78 39.88,30.29 38.49,29.27 23.37,49.85 23.25,47.94 43.44,25.59 46.11,25.59 48.77,25.59 51.44,25.59 49.03,31.31 37.09,30.29 33.41,42.23 27.95,50.99 30.11,50.93 13.09,43.12 12.2,33.97 19.44,31.94 24.01,30.42 12.96,32.07 20.77,25.08 58.55,35.5 56.52,35.5 57.54,34.48 25.66,50.86 30.61,35.37 18.55,43.5 18.68,39.69 20.01,42.1 10.93,23.81 10.93,26.61 13.98,15.62 14.99,17.78 14.87,15.75 13.98,14.99 16.52,15.11 16.14,22.1 16.01,19.94 14.36,28.96 37.09,44.26 39.88,44.26 38.49,45.15 51.89,42.29 51.89,44.07 50.55,45.15 51.95,14.1 53.6,15.49 53.6,12.7 55.25,14.1 53.6,10.92 53.6,8.13 55.25,9.53 51.95,9.53 10.8,15.37 10.17,16.13 54.11,25.59 43.82,15.11 44.58,15.11 45.35,15.11 46.11,15.11 46.87,15.11 47.63,15.11 48.39,15.11 49.16,15.11 49.92,15.11 50.68,15.11 43.82,14.35 44.58,14.35 45.35,14.35 46.11,14.35 46.87,14.35 47.63,14.35 48.39,14.35 49.16,14.35 49.92,14.35 50.68,14.35 40.77,25.72 53.73,1.97 51.82,1.97 58.68,3.37 53.09,1.97 51.82,4 57.6,2.48 57.03,4.57 51.19,1.97 55.25,4 59.7,11.56 61.41,26.35 59.7,17.91 59.7,18.54 59.7,12.19 61.41,24.32 59.51,26.1 59.7,22.35 59.7,14.1 59.7,12.83 59.7,10.29 59.76,23.62 59.7,19.18 59.7,9.65 60.71,24.32 59.7,16.64 59.7,16 59.7,13.46 59.7,14.73 59.7,15.37 59.7,7.11 59.7,10.92 58.17,2.86 59.7,21.72 59.7,17.27 59.7,6.48 59.7,7.75 59.7,5.84 59.7,8.38 59.63,5.21 56.27,2.1 57.41,5.08 57.66,5.71 57.66,6.41 55.63,2.03 55,1.97 54.36,1.97 52.46,1.97 56.97,2.22 59.44,4.57 59.12,3.94 59.7,9.02 43.82,13.59 44.58,13.59 45.35,13.59 46.11,13.59 46.87,13.59 47.63,13.59 48.39,13.59 49.16,13.59 49.92,13.59 50.68,13.59 43.82,12.83 44.58,12.83 45.35,12.83 46.11,12.83 46.87,12.83 47.63,12.83 48.39,12.83 49.16,12.83 49.92,12.83 50.68,12.83 43.82,12.06 44.58,12.06 45.35,12.06 46.11,12.06 46.87,12.06 47.63,12.06 48.39,12.06 49.16,12.06 49.92,12.06 50.68,12.06 43.82,11.3 44.58,11.3 45.35,11.3 46.11,11.3 46.87,11.3 47.63,11.3 48.39,11.3 49.16,11.3 49.92,11.3 50.68,11.3 43.82,10.54 44.58,10.54 45.35,10.54 46.11,10.54 46.87,10.54 47.63,10.54 48.39,10.54 49.16,10.54 49.92,10.54 50.68,10.54 43.82,9.78 44.58,9.78 45.35,9.78 46.11,9.78 46.87,9.78 47.63,9.78 48.39,9.78 49.16,9.78 49.92,9.78 50.68,9.78 59.7,22.99 59.7,21.08 59.7,20.45 59.7,19.81 60.14,24.07 56.9,18.99 56.9,12.89 55.89,4.06 26.8,29.27 5.09,0.64 6.36,0.64 7.63,0.64 8.9,0.64 10.17,0.64 11.44,0.64 12.71,0.64 13.98,0.64 15.25,0.64 16.52,0.64 17.79,0.64 19.06,0.64 20.33,0.64 21.6,0.64 22.87,0.64 24.14,0.64 25.41,0.64 26.68,0.64 27.95,0.64 29.22,0.64 30.49,0.64 31.76,0.64 33.03,0.64 34.3,0.64 35.57,0.64 36.84,0.64 38.11,0.64 39.38,0.64 40.65,0.64 41.92,0.64 43.19,0.64 44.46,0.64 45.73,0.64 47,0.64 48.27,0.64 49.54,0.64 50.81,0.64 52.08,0.64 53.35,0.64 54.62,0.64 55.89,0.64 57.16,0.64 58.43,0.64 59.7,0.64 60.97,0.64 5.09,54.04 6.36,54.04 7.63,54.04 8.9,54.04 10.17,54.04 11.44,54.04 12.71,54.04 13.98,54.04 15.25,54.04 16.52,54.04 17.79,54.04 19.06,54.04 20.33,54.04 21.6,54.04 25.41,54.04 27.95,54.04 30.49,54.04 31.76,54.04 57.16,54.04 58.43,54.04 59.7,54.04 60.97,54.04 66.05,5.08 66.05,6.35 66.05,7.62 66.05,8.89 66.05,10.16 66.05,11.43 66.05,12.7 66.05,13.97 66.05,15.24 66.05,16.51 66.05,17.78 66.05,31.94 66.05,33.21 10.1,39.62 8.39,38.86 6.61,40.07 57.66,9.53 57.66,8.89 57.66,10.79 57.66,10.16 57.66,18.8 57.66,11.43 57.66,18.16 57.66,17.53 57.66,16.89 57.66,14.99 57.66,12.06 57.66,12.7 57.66,16.26 57.66,15.62 53.16,44.07 54.43,44.07 53.79,44.07 55.06,44.07 55.7,44.01 52.52,44.07 52.52,42.29 58.05,24.77 58.93,25.78 57.66,20.95 57.66,21.59 57.66,22.23 57.66,22.86 57.66,23.5 57.79,24.13 58.43,25.34 53.16,42.29 53.79,42.29 54.43,42.29 55.06,42.29 55.7,42.1 56.14,41.66 56.58,41.21 57.03,40.77 58.68,39.12 59.12,38.8 59.7,38.54 60.27,38.35 61.41,38.29 56.39,43.88 56.97,43.56 57.47,43.18 57.98,42.67 58.43,42.23 58.87,41.85 59.38,41.4 59.76,40.96 60.14,40.39 60.78,40.32 61.41,40.32 56.9,6.79 51.19,4 56.52,4.25 24.96,35.56 60.84,38.29 21.02,33.34 22.49,33.34 27.88,40.39 33.41,44.89 33.53,40.07 29.98,41.72 19.18,46.93 21.98,46.93 60.08,26.29 60.71,26.35 10.48,3.17 10.48,6.86 12.71,6.86 12.71,3.17 11.56,4.64 11.56,1.71 11.56,5.4 11.56,8.32 33.85,48.32 34.87,47.62 48.27,54.04 49.54,54.04 50.81,54.04 52.08,54.04 53.35,54.04 54.62,54.04 55.89,54.04 22.87,54.04 24.14,54.04 26.68,54.04 29.22,54.04 47,54.04 22.29,43.75 24.83,43.5 25.22,38.42 21.91,38.54 20.14,39.43 34.3,54.04 35.57,54.04 36.84,54.04 38.11,54.04 39.38,54.04 40.65,54.04 41.92,54.04 44.46,54.04 45.73,54.04 0.64,5.08 0.64,6.35 0.64,7.62 0.64,8.89 0.64,10.16 0.64,11.43 0.64,12.7 0.64,13.97 0.64,15.24 0.64,16.51 0.64,17.78 0.64,19.05 0.64,20.32 0.64,21.59 0.64,22.86 0.64,24.13 0.64,25.4 0.64,26.67 0.64,27.94 0.64,29.21 0.64,30.48 0.64,31.75 0.64,33.02 0.64,34.29 0.64,35.56 0.64,36.83 0.64,38.1 0.64,39.37 0.64,40.64 0.64,41.91 0.64,43.18 0.64,44.45 0.64,45.72 0.64,46.99 0.64,48.26 0.64,49.53 66.05,49.53 66.05,48.26 66.05,46.99 33.03,54.17 43.19,54.17
  pour Top (rank 6): -0.63,-0.64 67.32,-0.64 67.32,55.44 -0.63,55.44
  pour Route2 (rank 6): -1.26,-1.27 67.57,-1.27 67.57,56.52 -1.26,56.52
  pour Bottom (rank 6): -2.53,-2.54 69.22,-2.54 69.22,57.78 -2.53,57.78
  pour Top (rank 5, no thermals): 66.68,19.3 61.09,19.3 61.09,45.66 66.68,45.66
  pour Bottom (rank 5, no thermals): 66.68,19.3 61.09,19.3 61.09,45.66 66.68,45.66
GPS_VCC_RF
  Top 0.508: IC2.9 52.75,40.96 R10.1
I2C3_SCL
  Top 0.152: IC1.41 23,47.3 22.32,47.98 R14.1 22.32,49.55 23.03,50.27 IC4.4
I2C3_SDA
  Top 0.152: IC1.40 23.5,47.3 24.43,48.24 R13.1 24.43,49.55 23.68,50.3 IC4.3
LED1  (via drill 0.25)
  Top 0.152: IC1.55 16.4,40.95 v15.96,40.5 | v8.9,34.23 8.77,34.1 R6.1
  Bottom 0.152: v15.96,40.5 15.59,40.13 15.59,39.17 13.62,37.2 12.86,37.2 9.88,34.23 v8.9,34.23
LED2  (via drill 0.25)
  Top 0.152: v16.02,39.67 16.02,39.95 16.52,40.45 IC1.56 | R7.1 8.06,32.41 8.06,32.52 8.46,32.92 8.46,33.13 8.9,33.57 v8.9,33.59
  Bottom 0.152: v16.02,39.67 16.02,39.21 13.73,36.92 12.97,36.92 9.64,33.59 v8.9,33.59
LED3  (via drill 0.25)
  Top 0.152: IC1.57 16.65,39.95 16.52,39.81 v16.52,39.31 | R8.1 7.59,30.6 8.34,31.36 8.34,32.4 v8.9,32.96
  Bottom 0.152: v16.52,39.31 13.85,36.64 13.09,36.64 9.4,32.96 v8.9,32.96
MCU_BUTTON  (via drill 0.25)
  Top 0.152: IC1.54 18.25,41.45 v18.55,41.15
  Bottom 0.152: 16.48,38.88 16.7,38.88 18.55,40.73 v18.55,41.15 | 16.48,38.88 16.43,38.82 | 16.48,38.88 13.97,36.36 13.2,36.36 7.83,30.99 5.47,30.99 2.8,28.32 SW1.1
N$2
  Top 0.152: IC1.31 31.39,43.45 C19.1
N$3
  Top 0.127: IC1.47 20,45.1 19.99,45.09 19.99,45.06 19.44,44.51 15.18,44.51 C18.1
N$4
  Top 0.152: IC2.8 50.48,38.88 52.2,37.15 R1.1
N$5
  Top 0.152: D2.C R7.2
N$7
  Top 0.152: D3.C 5.76,29.91 R8.2
N$8
  Top 0.152: D1.C 5.76,33.97 R6.2
N$9
  Top 0.152: 57.44,37.33 C22.1
  Top 0.508: R10.2 C23.1 57.43,39.35 arc-45 L5.2 arc-45 57.54,39.12 C22.1
N$10
  Top 0.152: D4.A R9.1
N$11
  Top 0.152: C1.1 32.01,26.23 32.58,25.65 33.22,25.65 33.75,25.12 R3.1
N$12
  Top 0.152: R18.1 24.92,25.97 26.69,25.97 26.78,26.06 27.65,26.06 C24.2
N$14
  Top 0.152: C1.2 30.8,25.78 26.89,25.78 R2.2 26.23,20.64 23.11,17.51 IC5.18
N$15
  Top 0.318: 58.64,16.04 L4.1
  Top 0.356: L3.2 58.68,13.8 L4.1
  Top 1.016: 58.68,13.8 C33.1
N$17
  pour Top: 11.56,16 13.09,16 13.09,8.89 10.29,8.89 10.29,14.48 11.56,14.48
N$18
  Top 0.152: IC5.3 30.68,20.64 28.96,22.35 C24.1
N$21
  Top 0.152: IC3.9 15.89,18.49 C27.1
NEO_PPS  (via drill 0.25)
  Top 0.152: IC1.26 29.75,40.95 v29.98,40.71 | IC2.3 48.77,32.46 48.39,32.83 v48.39,40.7 48.39,45.4 49.03,46.04 55.44,46.04 56.33,46.93 R9.2
  Bottom 0.152: v29.98,40.71 30.5,40.7 v48.39,40.7
NEO_RF
  Top 0.356: IC2.11 51.84,43.16 55.09,43.16 arc-45 56.7,42.49 L5.1 59.21,39.98 arc45 60.83,39.31 J4.S
NEO_RX
  Top 0.152: IC2.21 37.25,33.56 36.43,34.38 33.82,34.38 32.75,35.45 32.75,37.36 30.49,39.62 30.49,41.85 29.89,42.45 IC1.29
NEO_TX
  Top 0.152: IC2.20 33.94,34.66 33.03,35.57 33.03,37.47 30.77,39.73 30.77,41.96 29.78,42.95 IC1.30
SWD_SWCLK  (via drill 0.25)
  Top 0.152: 17.51,43.93 IC1.49 v19.12,43.95 | v45.22,49.53 45.98,50.29 J3.2
  Bottom 0.152: v19.12,43.95 21.31,43.95 21.98,44.62 26.98,44.62 31.75,49.38 45.07,49.38 v45.22,49.53
SWD_SWDIO  (via drill 0.25)
  Top 0.152: IC1.46 20.5,45.1 20.71,44.9 v21.22,44.9 | J3.5 v50.87,50.29
  Bottom 0.152: v21.22,44.9 26.87,44.9 31.63,49.66 44.73,49.66 45.37,50.29 v50.87,50.29
USB_N
  Top 0.127: IC1.44 21.5,46.61 21.37,46.73 21.37,47.27 21.08,47.56 19.8,47.56 19.3,48.06 19.3,49.05 18.41,49.95 13.41,49.95 11.37,47.91 11.37,42.22 10.88,41.73 9.99,41.73 9.71,42.01 J1.D-
USB_P
  Top 0.127: IC1.45 21,46.61 21.12,46.73 21.12,47.17 20.98,47.31 19.69,47.31 19.05,47.96 19.05,48.95 18.3,49.69 13.51,49.69 11.63,47.81 11.63,42.12 10.99,41.48 9.99,41.48 9.73,41.21 J1.D+
V_BATT
  pour Top: 13.6,17.53 9.4,17.53 9.4,13.65 6.61,13.65 6.61,18.92 8.4,18.92 8.4,19.49 8.4,22.48 12.9,22.48 12.9,26.67 15.25,26.67 15.25,21.84 15.12,21.72 15.12,18.41 13.6,18.41
VBAT_VSENSE  (via drill 0.25)
  Top 0.152: R16.1 R17.2 16.1,28.79 v16.2,28.89 | IC1.15 26.5,33.48 v26.49,33.47
  Bottom 0.152: v16.2,28.89 24.26,28.89 26.49,31.11 v26.49,33.47
VDDA_FILTERED
  Top 0.152: 26.97,32.03 C12.1 | L1.2 C16.1 27.28,32.13 C12.1 | C12.1 27.18,32.32 | C12.1 27.18,32.77 26.93,33.02 26.3,33.02 25.5,33.82 IC1.13
XTAL_IN
  Top 0.152: IC1.5 21.5,31.25 X1.1 18.45,30.3 C20.1
XTAL_OUT
  Top 0.152: IC1.6 22,32.95 X1.3 22.92,32.03 C21.1
(copper drawn outside any net)
  shapes: Top area x2155

### Text on the board
tPlace: G | V | C | D | R | U | PPS | + | - | 3.3V-17V